# EAGLE design CAT6 snake 2ch (EAGLE 7.2.0)
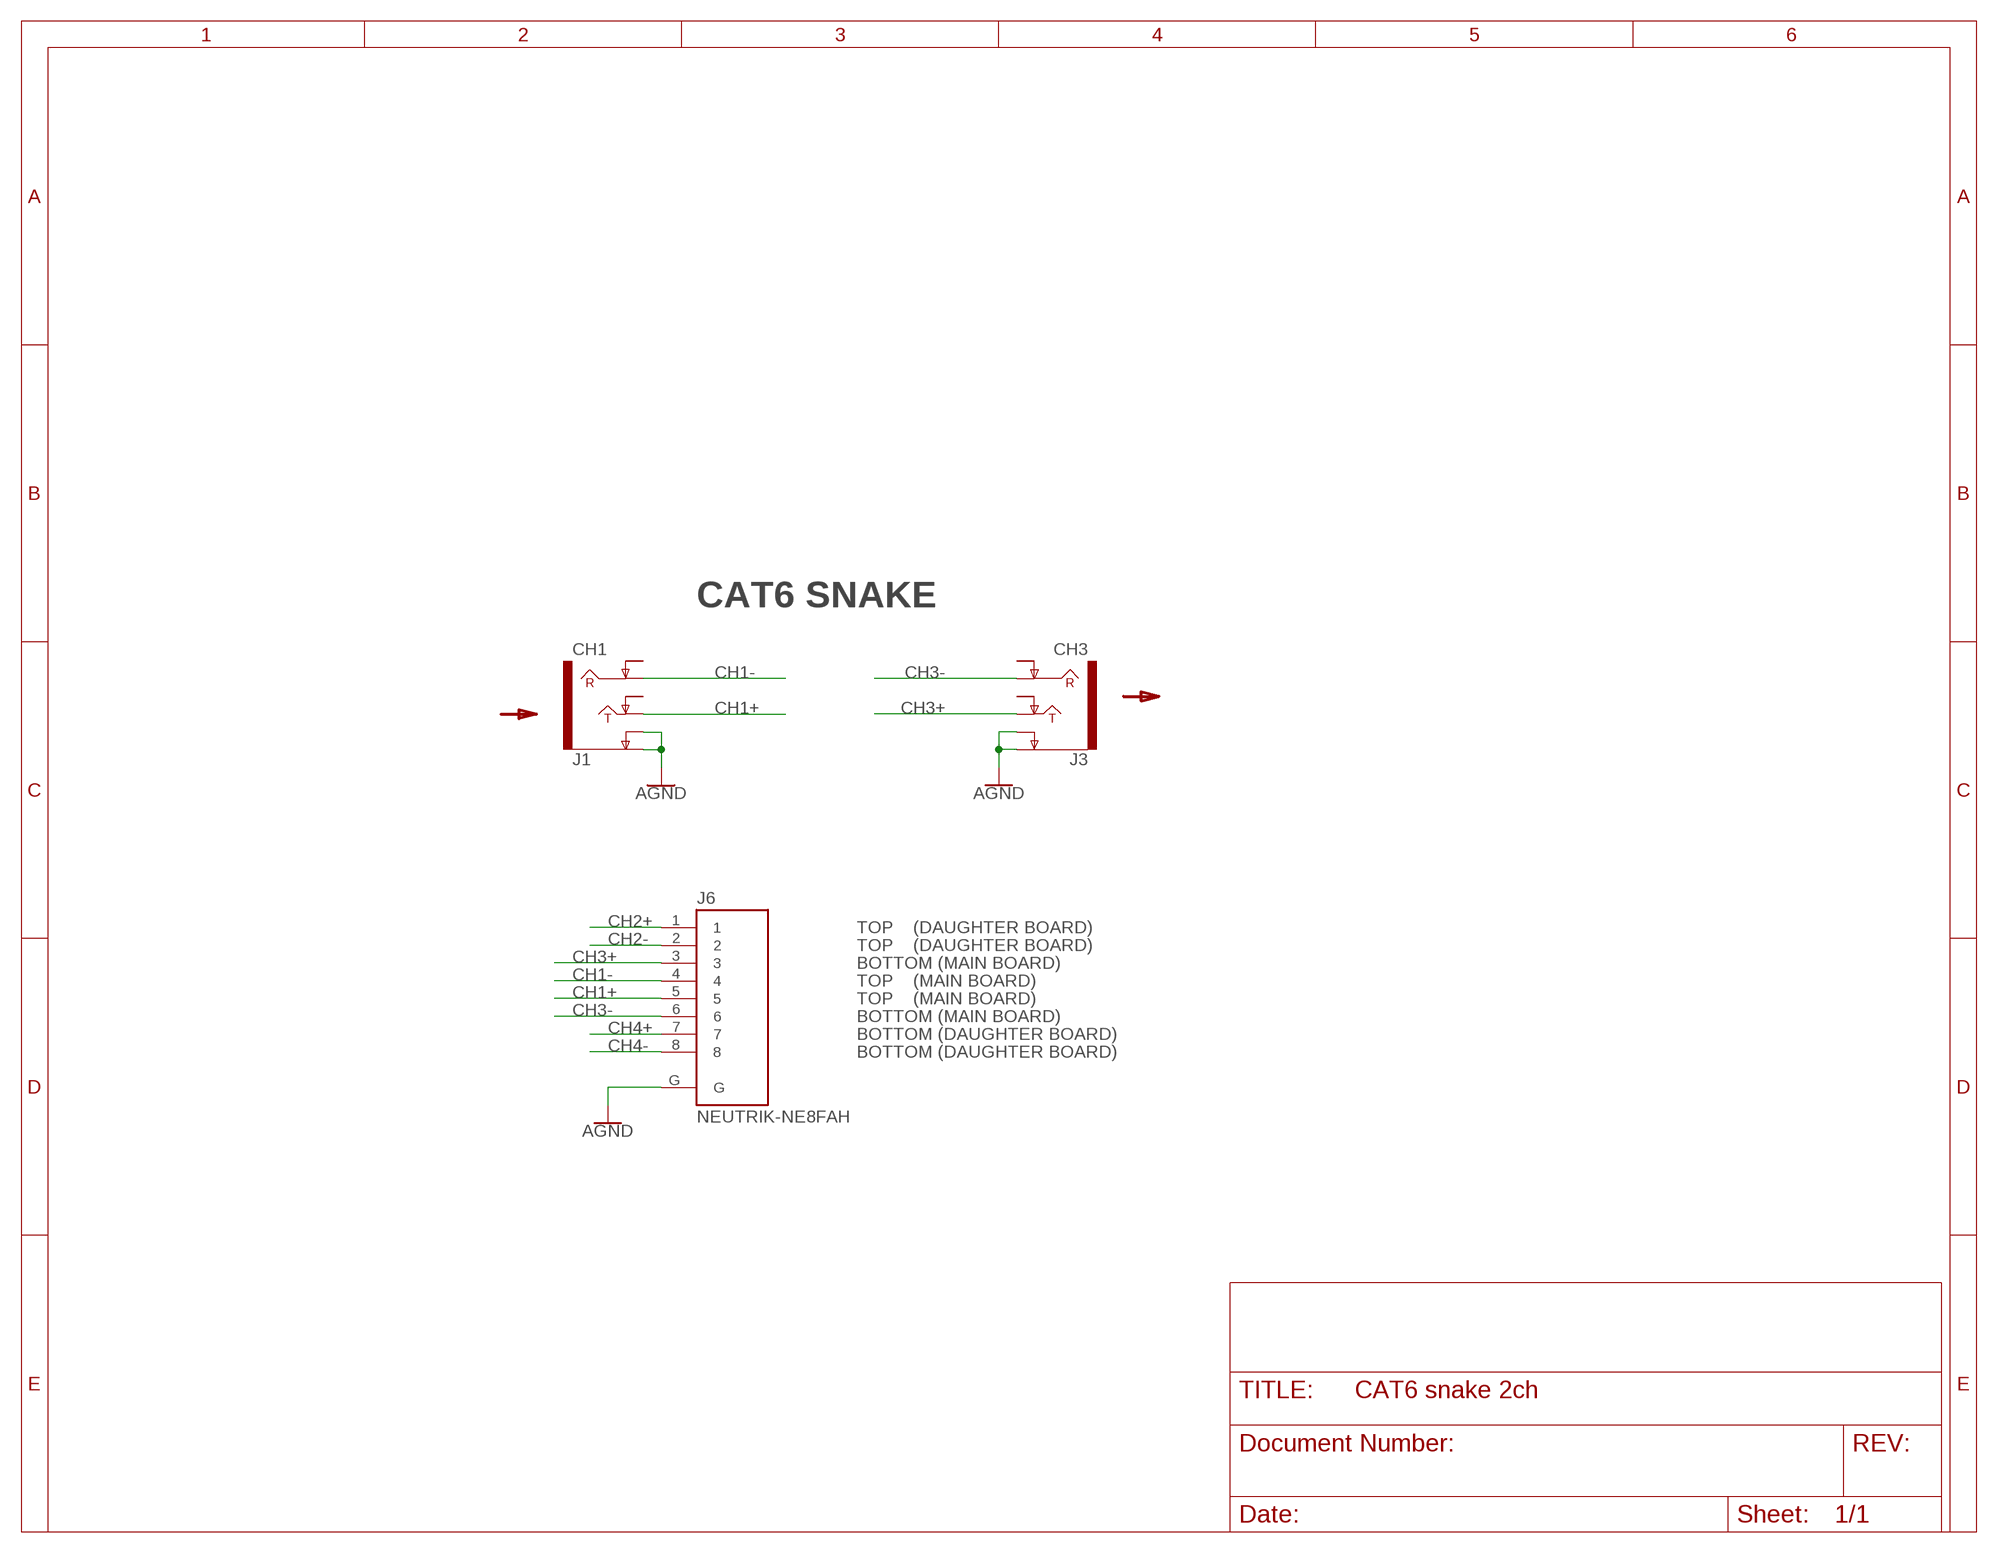
[diagram p0: schematic, sheet 1]

## Parts
J1  CH1  AUDIO_JACK_TRS_0.25"_PTH_RA-NRJ6HM  [NEUTRIK-NRJ6HF]
J3  CH3  AUDIO_JACK_TRS_0.25"_PTH_RA-NRJ6HM  [NEUTRIK-NRJ6HF]
J6  NEUTRIK-NE8FAH  [NEUTRIK_NE8FAH]

## Nets
AGND: J1.S(EARTH) J1.SN(EARTH-NORM) J3.S(EARTH) J3.SN(EARTH-NORM) J6.G
CH1+: J1.T(TIP) J6.5
CH1-: J1.R(RING) J6.4
CH2+: J6.1
CH2-: J6.2
CH3+: J3.T(TIP) J6.3
CH3-: J3.R(RING) J6.6
CH4+: J6.7
CH4-: J6.8
Unconnected: J1.RN(RING-NORM) J1.TN(TIP-NORM) J3.RN(RING-NORM) J3.TN(TIP-NORM)

## Notes on the sheet
- CAT6 SNAKE
- TOP    (DAUGHTER BOARD)
- TOP    (DAUGHTER BOARD)
- BOTTOM (MAIN BOARD)
- TOP    (MAIN BOARD)
- TOP    (MAIN BOARD)
- BOTTOM (MAIN BOARD)
- BOTTOM (DAUGHTER BOARD)
- BOTTOM (DAUGHTER BOARD)

## Library data of the parts
J1 J3 = !frankendeck:AUDIO_JACK_TRS_0.25"_PTH_RA: Audio Jack, 1/4" TRS jack, horizontal, PTH, aka "Phono jack" Find the connector here: Audio Jack - 1/4" Stereo (right angle) <https://www.sparkfun.com/products/11144> (COM-11144) Datasheet <http://cdn.sparkfun.com/datasheets/Components/General/JP-611%20DD.jpg> Note, although the datasheet and physical part are slightly different, this footprint was proven to mate well on the Proto Pedal. This device is used on these SparkFun Products: SparkFun TRS Jack Breakout - 1/4" Stereo <https://www.sparkfun.com/products/13005> (BOB-13005 ) SparkFun Proto Pedal - sorry bad link - product comming soon! <https://www.sparkfun.com/products/13124> (PRT-13124); PROD_ID: CONN-12339; SF_ID: COM-11144
J6 = !frankendeck:NEUTRIK-NE8FAH: Check availability <https://pricing.snapeda.com/parts/NE8FAH/Neutrik/view-part?ref=eda>; AVAILABILITY: In Stock; DESCRIPTION: Horizonal PCB mount RJ45 receptacle, A-Series cutout with latch lock, max. panel thickness 3 mm; MF: Neutrik; MP: NE8FAH; PACKAGE: None; PRICE: None; PURCHASE-URL: https://pricing.snapeda.com/search/part/NE8FAH/?ref=eda

## Board
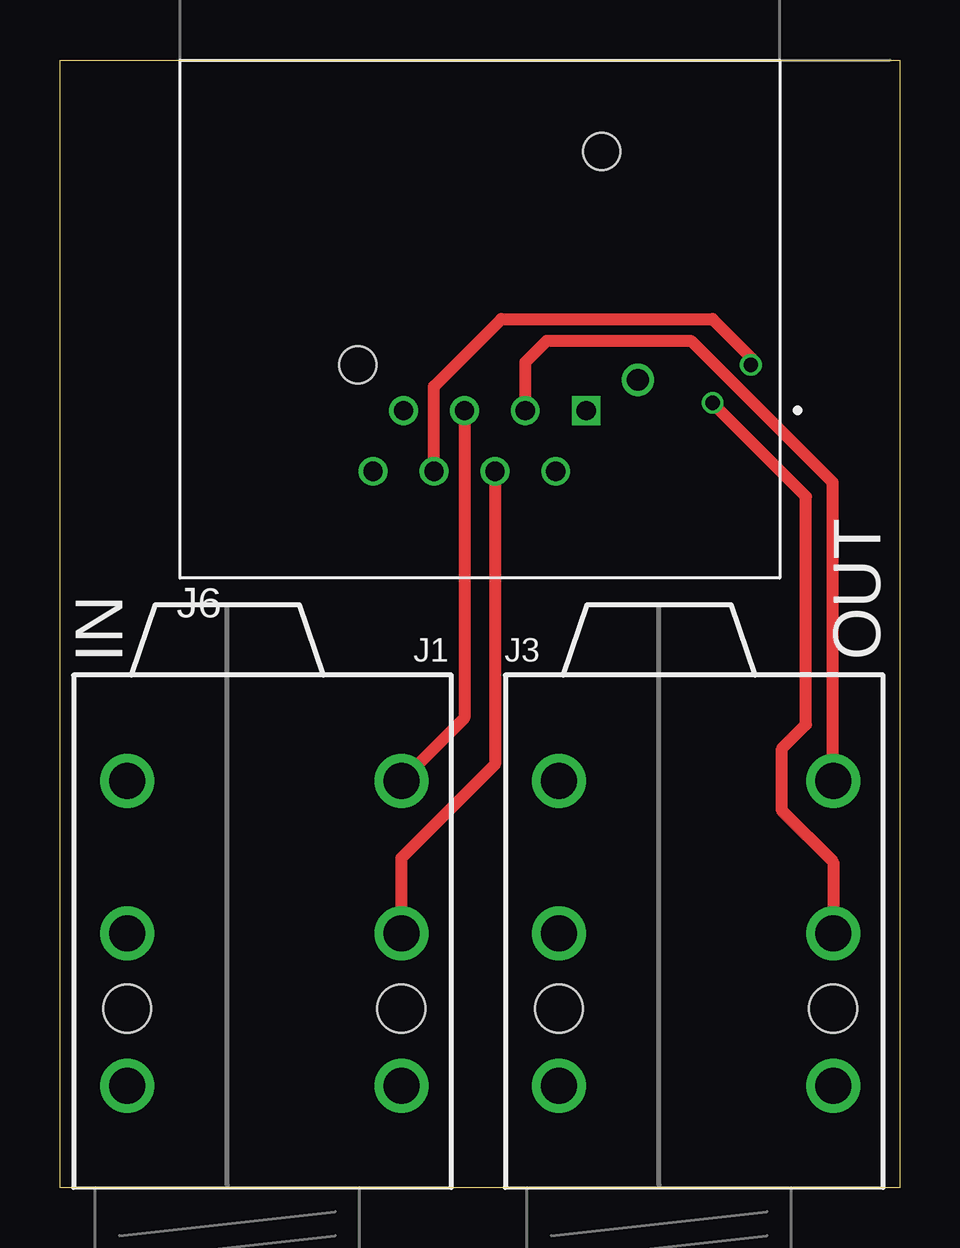
[diagram p1: board, top side]
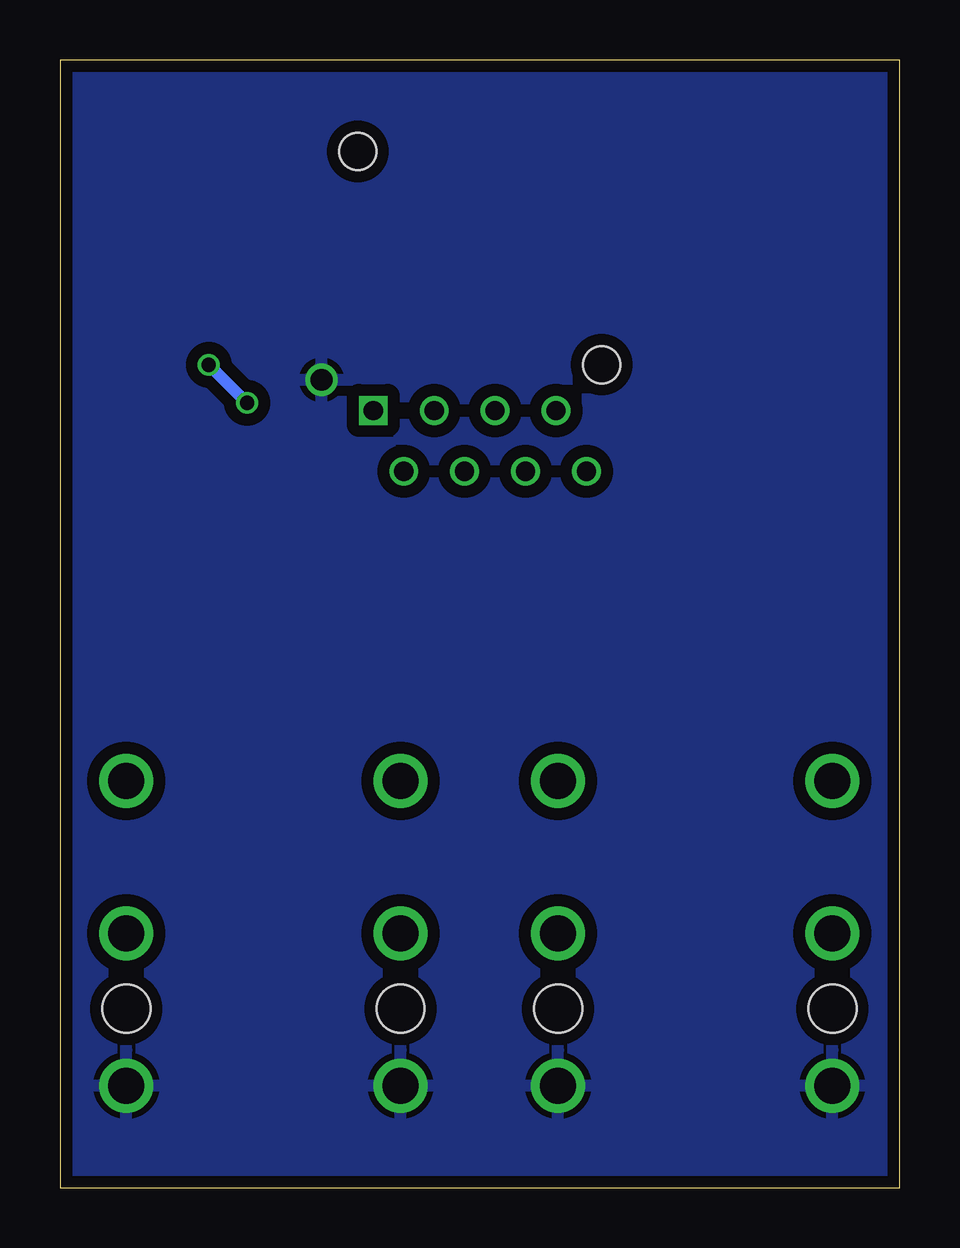
[diagram p2: board, bottom side, seen from below]

Size 35 x 47 mm. Coordinates in mm from the lower left corner, seen from the top.
Outline: 0,47 35,47 35,0 0,0 0,47
Copper layers (1*16): Top 0.035559375mm / dielectric 1.6mm / Bottom 0.035559375mm
Design rules "jlcpcb2layer": minimum track width 5mil, minimum drill 12mil, track to track 5mil, track to pad 5mil, pad to pad 5mil, via to via 5mil, smd to smd 5mil, copper to edge 8mil, drill to drill 6mil, minimum pad ring 5mil, minimum via ring 3mil, stop-mask expansion 2.5mil, vias tented up to drill 15mil, thermal gap 10mil

### Footprints (pad centres in the part's own frame; a part is rotated, then mirrored left to right if it is on the bottom)
NEUTRIK-NRJ6HF = drill 1.5: R -10.6,7.23; RN -10.6,-4.2; S -4.25,7.23; SN -4.25,-4.2; T -16.95,7.23; TN -16.95,-4.2 | hole 2: -7.45,7.23; -7.45,-4.2
NEUTRIK_NE8FAH = drill 0.8 square: 1 4.44,-14.61 | drill 0.8: 2 3.17,-17.15; 3 1.9,-14.61; 4 0.63,-17.15; 5 -0.64,-14.61; 6 -1.91,-17.15; 7 -3.18,-14.61; 8 -4.45,-17.15 | drill 0.9: G 6.595,-13.34 | hole 1.55: 5.08,-3.81; -5.08,-12.7

### Placement (x,y rotation side)
J1  7,0 270 top
J3  25,0 270 top
J6  17.5,47 0 top

### Tracks (layer width: path | path; a pad name or v marks a point on that pad's centre or on a via)
AGND
  pour Bottom (isolate 0.5): 0,47 35,47 35,0 0,0
CH1+
  Top 0.5: J6.5 16.86,19.58 J1.T
CH1-
  Top 0.5: J6.4 18.13,17.63 14.23,13.73 J1.R
CH3+
  Top 0.5: J6.3 19.4,34.4 20.3,35.3 26.3,35.3 32.2,29.4 32.2,16.98 J3.T
CH3-  (via drill 0.6)
  Top 0.5: J3.R 32.23,13.57 30.1,15.7 30.1,18.3 31.1,19.3 31.1,28.8 v27.2,32.7 | v28.8,34.3 28.8,34.6 27.2,36.2 18.4,36.2 15.59,33.39 J6.6
  Bottom 0.5: v27.2,32.7 v28.8,34.3

### Text on the board
tPlace: IN | OUT